# Altium schematic sheet [06] BLUETOOTH.SchDoc: Template
size A4; Author: Hom; CompanyName: KitSprout; DrawnBy: Hom; Engineer: Hom; Organization: KitSprout; Revision: A; SheetNumber: 5; SheetTotal: 6; Version: 0.0; LibVersion: 0.0
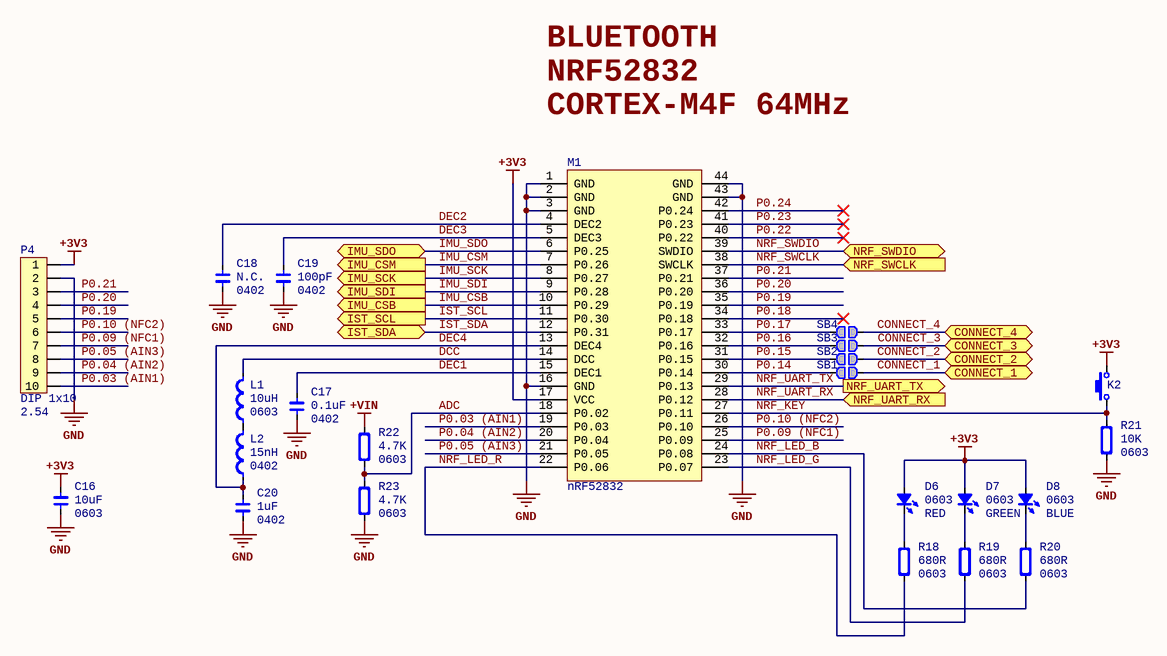
[diagram p0: [06] BLUETOOTH.SchDoc]

## Parts
C16  Type: 0603  [CAP_0603]  (hidden comment: 10uF)
C17  Type: 0402  [CAP_0402]  (hidden comment: 0.1uF)
C18  Type: 0402  [CAP_0402]  (hidden comment: N.C.)
C19  Type: 0402  [CAP_0402]  (hidden comment: 100pF)
C20  Type: 0402  [CAP_0402]  (hidden comment: 1uF)
D6  Type: 0603  [LED_0603_RED]  (hidden comment: RED)
D7  Type: 0603  [LED_0603_GREEN]  (hidden comment: GREEN)
D8  Type: 0603  [LED_0603_BLUE]  (hidden comment: BLUE)
K2  ButtonTACT  [ButtonTACT_3x4x2_180H]  (value not drawn)
L1  Type: 0603  [IND_0603]  (hidden comment: 10uH)
L2  Type: 0402  [IND_0402]  (hidden comment: 15nH)
M1  value nRF52832  [E73-2G4M04S]  (hidden comment: BT_E73-2G4M04S)
P4  value 2.54  [HDR1X10_2.54_180]  (hidden comment: DIP 1x10)
R18  Type: 0603  [RES_0603]  (hidden comment: 680R)
R19  Type: 0603  [RES_0603]  (hidden comment: 680R)
R20  Type: 0603  [RES_0603]  (hidden comment: 680R)
R21  Type: 0603  [RES_0603]  (hidden comment: 10K)
R22  Type: 0603  [RES_0603]  (hidden comment: 4.7K)
R23  Type: 0603  [RES_0603]  (hidden comment: 4.7K)
SB1  Solderbridge  [Solderbridge]  (value not drawn)  (no BOM)
SB2  Solderbridge  [Solderbridge]  (value not drawn)  (no BOM)
SB3  Solderbridge  [Solderbridge]  (value not drawn)  (no BOM)
SB4  Solderbridge  [Solderbridge]  (value not drawn)  (no BOM)

## Ports
CONNECT_1, CONNECT_2, CONNECT_3, CONNECT_4, IMU_CSB (out), IMU_CSM (out), IMU_SCK (out), IMU_SDI (out), IMU_SDO, IST_SCL (out), IST_SDA (bidir), NRF_SWCLK (in), NRF_SWDIO (bidir), NRF_UART_RX (in), NRF_UART_TX (out)

## Nets
+3V3: C16.2 D6.1(A) D7.1(A) D8.1(A) K2.2 M1.17(VCC) P4.1
+VIN: R22.2
GND: C16.1 C17.1 C18.1 C19.1 C20.1 M1.1(GND) M1.2(GND) M1.3(GND) M1.16(GND) M1.43(GND) M1.44(GND) P4.2 R21.1 R23.1
ADC: M1.18(P0.02) R22.1 R23.2
CONNECT_1: SB1.2 ; port CONNECT_1
CONNECT_2: SB2.2 ; port CONNECT_2
CONNECT_3: SB3.2 ; port CONNECT_3
CONNECT_4: SB4.2 ; port CONNECT_4
DCC: L1.2 M1.14(DCC)
DEC1: C17.2 M1.15(DEC1)
DEC2: C18.2 M1.4(DEC2)
DEC3: C19.2 M1.5(DEC3)
DEC4: C20.2 L2.1 M1.13(DEC4)
IMU_CSB: M1.10(P0.29) ; port IMU_CSB
IMU_CSM: M1.7(P0.26) ; port IMU_CSM
IMU_SCK: M1.8(P0.27) ; port IMU_SCK
IMU_SDI: M1.9(P0.28) ; port IMU_SDI
IMU_SDO: M1.6(P0.25) ; port IMU_SDO
IST_SCL: M1.11(P0.30) ; port IST_SCL
IST_SDA: M1.12(P0.31) ; port IST_SDA
NRF_KEY: K2.1 M1.27(P0.11) R21.2
NRF_LED_B: M1.24(P0.08) R20.1
NRF_LED_G: M1.23(P0.07) R19.1
NRF_LED_R: M1.22(P0.06) R18.1
NRF_SWCLK: M1.38(SWCLK) ; port NRF_SWCLK
NRF_SWDIO: M1.39(SWDIO) ; port NRF_SWDIO
NRF_UART_RX: M1.28(P0.12) ; port NRF_UART_RX
NRF_UART_TX: M1.29(P0.13) ; port NRF_UART_TX
P0.03 (AIN1): M1.19(P0.03) P4.10
P0.04 (AIN2): M1.20(P0.04) P4.9
P0.05 (AIN3): M1.21(P0.05) P4.8
P0.09 (NFC1): M1.25(P0.09) P4.7
P0.10 (NFC2): M1.26(P0.10) P4.6
P0.14: M1.30(P0.14) SB1.1
P0.15: M1.31(P0.15) SB2.1
P0.16: M1.32(P0.16) SB3.1
P0.17: M1.33(P0.17) SB4.1
P0.18: M1.34(P0.18)
P0.19: M1.35(P0.19) P4.5
P0.20: M1.36(P0.20) P4.4
P0.21: M1.37(P0.21) P4.3
P0.22: M1.40(P0.22)
P0.23: M1.41(P0.23)
P0.24: M1.42(P0.24)
NetD6_2: D6.2(K) R18.2
NetD7_2: D7.2(K) R19.2
NetD8_2: D8.2(K) R20.2
NetL1_1: L1.1 L2.2

## Notes on the sheet
- BLUETOOTH
- NRF52832
- CORTEX-M4F 64MHz

## Library data of the parts
C16 = Cap_0603: Capacitor; Value: 10uF
C17-C20 = Cap_0402: Capacitor
  C17: Value: 0.1uF
  C18: Value: N.C.
  C19: Value: 100pF
  C20: Value: 1uF
D6-D8 = LED_0603: LED
  D6: Value: RED
  D7: Value: GREEN
  D8: Value: BLUE
K2 = ButtonTACT_3x4x2_180: Button; Value: ButtonTACT
L1 = Ind_0603: Inductor; Value: 10uH
L2 = Ind_0402: Inductor; Value: 15nH
M1 = BT_E73-2G4M04S: Module
P4 = HDR1x10_2.54T: Header; Type: DIP 1x10
R18-R23 = Res_0603: Resistor
  R18-R20: Value: 680R
  R21: Value: 10K
  R22 R23: Value: 4.7K
SB1-SB4 = Solderbridge: Value: Solderbridge